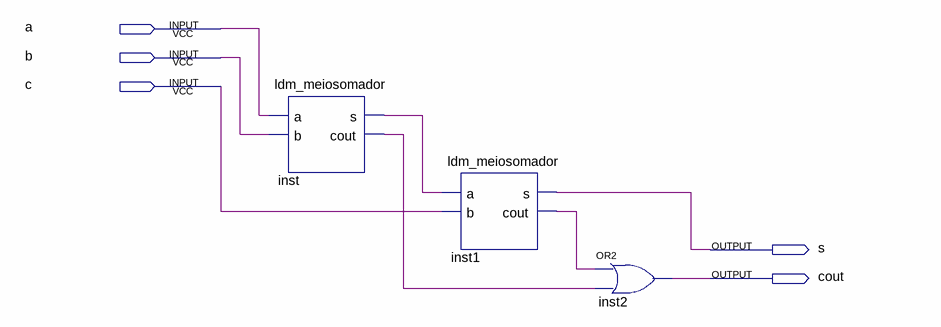
[diagram p0: schematic sheet]
// Quartus schematic ldm_somadorcompleto.bdf as structural Verilog: 3 symbols, 5 pins
module ldm_somadorcompleto (
  input  a,
  input  b,
  input  c,
  output s,
  output cout
);

  wire inst1_cout, inst_cout, inst_s;

  ldm_meiosomador inst (.a(a), .b(b), .s(inst_s), .cout(inst_cout));
  ldm_meiosomador inst1 (.a(inst_s), .b(c), .s(s), .cout(inst1_cout));
  or inst2 (cout, inst1_cout, inst_cout);
endmodule
